# Altium schematic sheet ESP_MainChip.SchDoc
size 381 x 241 mm; SheetNumber: 2; SheetTotal: 2
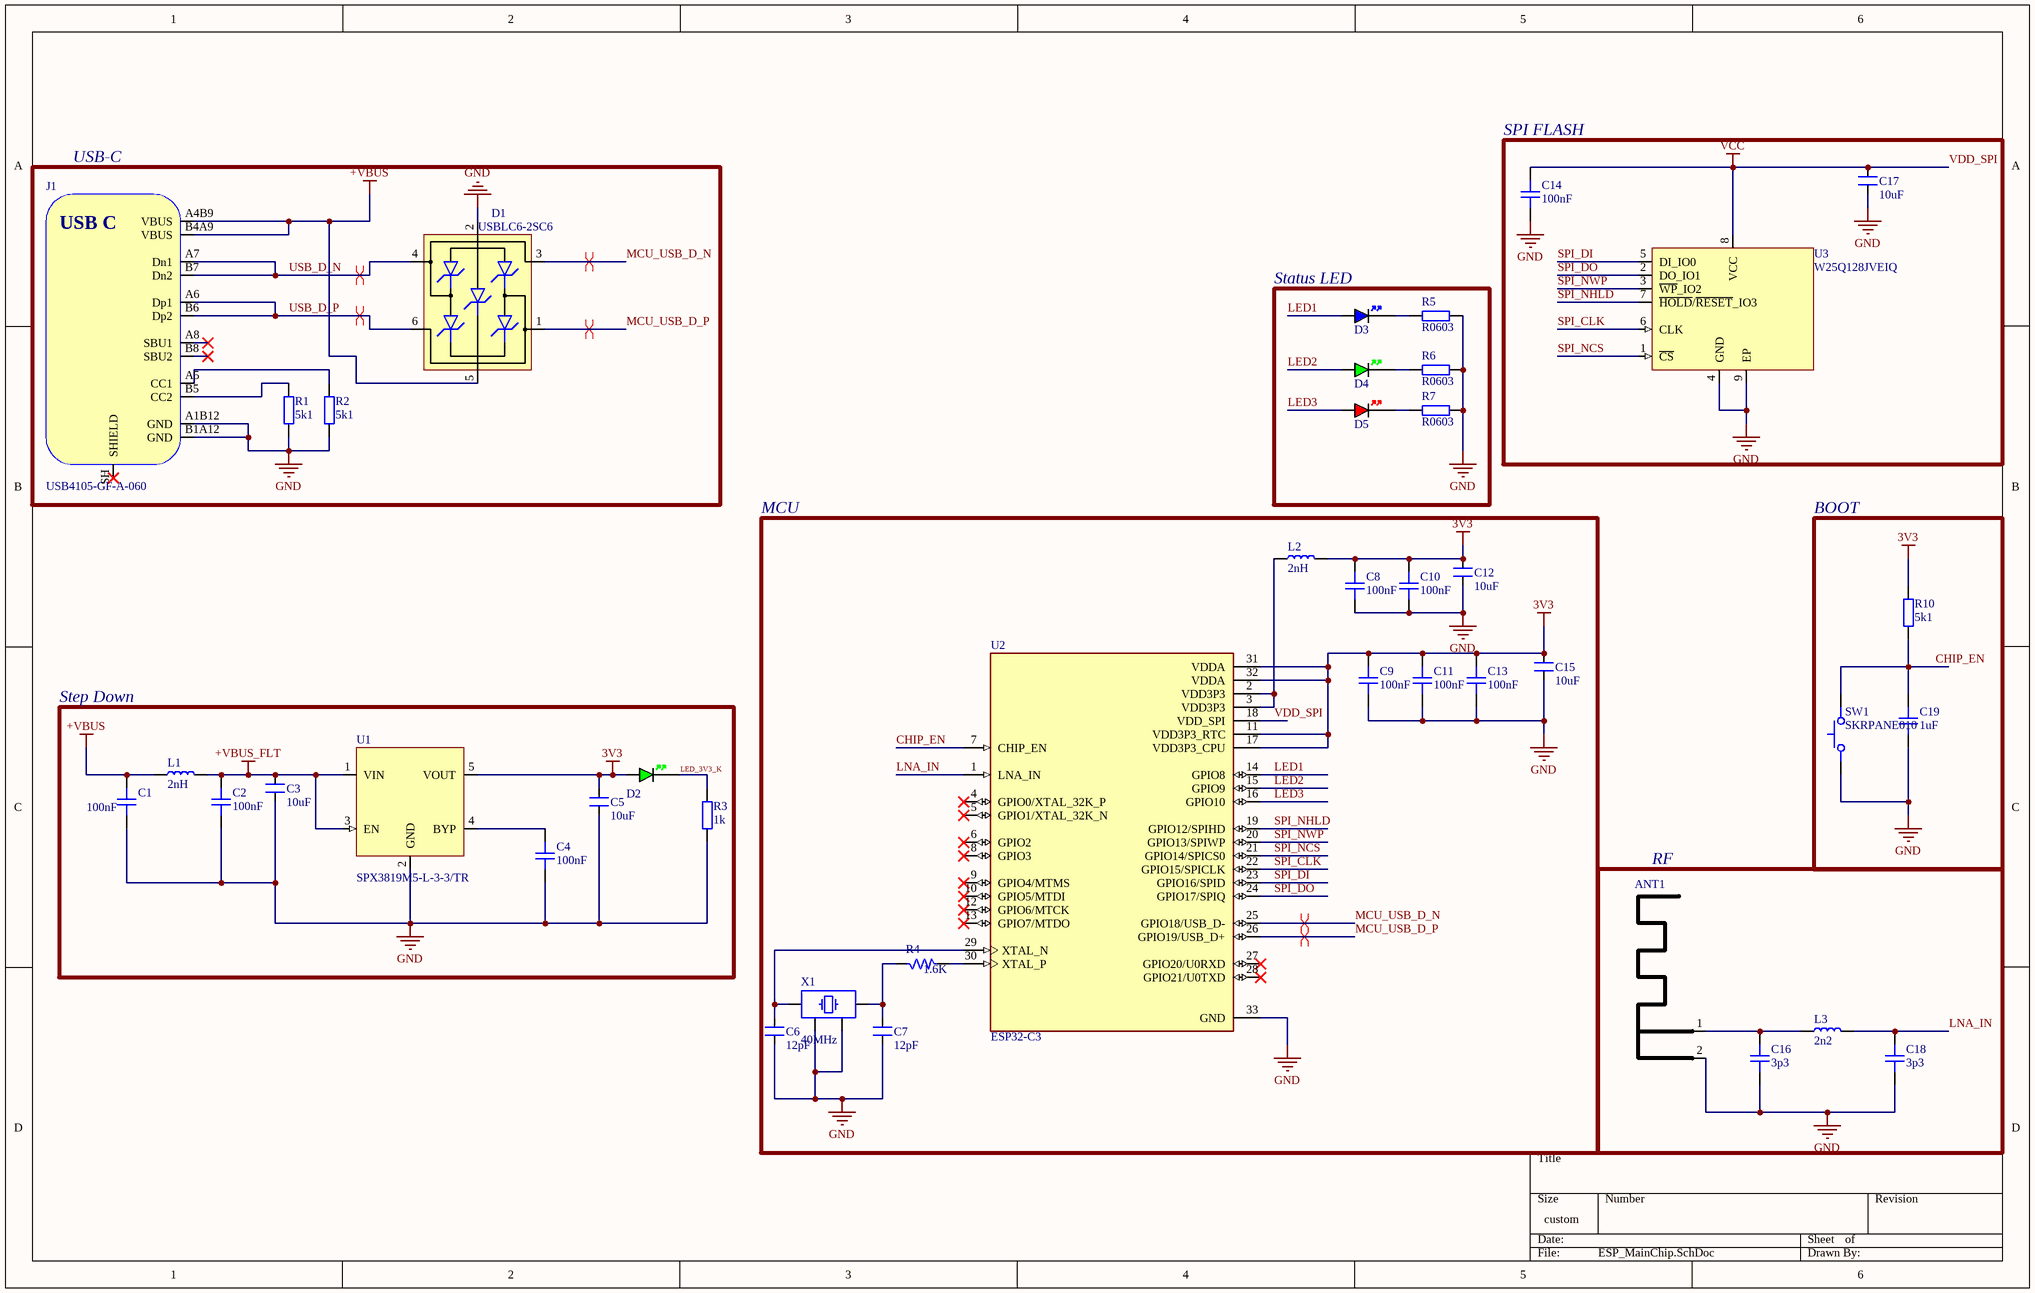
[diagram p0: ESP_MainChip.SchDoc]

## Parts
ANT1  PCB Antenna 2.4GHz 50Ohm  [ANT_IFA_USB_2_4GHZ_50R]  (value not drawn)  (no BOM)
C1  100nF  [CAP_0603]
C2  100nF  [CAP_0603]
C3  10uF  [CAP_1206]
C4  100nF  [CAP_0603]
C5  10uF  [CAP_1206]
C6  12pF  [CAP_0805]
C7  12pF  [CAP_0805]
C8  100nF  [CAP_0603]
C9  100nF  [CAP_0603]
C10  100nF  [CAP_0603]
C11  100nF  [CAP_0603]
C12  10uF  [CAP_1206]
C13  100nF  [CAP_0603]
C14  100nF  [CAP_0603]
C15  10uF  [CAP_1206]
C16  3p3  [CAP_0201]
C17  10uF  [CAP_1206]
C18  3p3  [CAP_0201]
C19  1uF  [CAP_0603]
D1  USBLC6-2SC6  [SOT-23-6]
D2  GREEN  [LED_0402_GREEN]  (value not drawn)
D3  BLUE  [LED_0402_BLUE]  (value not drawn)
D4  GREEN  [LED_0402_GREEN]  (value not drawn)
D5  RED  [LED_0402_RED]  (value not drawn)
J1  USB4105-GF-A-060  [USB4105-GF-A-060]
L1  2nH  [IND_0603]
L2  2nH  [IND_0603]
L3  2n2  [IND_1008]
R1  5k1  [RES_0805]
R2  5k1  [RES_0805]
R3  1k  [RES_0603]
R4  1.6K  [RES_0603]
R5  R0603  [RES_0603]
R6  R0603  [RES_0603]
R7  R0603  [RES_0603]
R10  5k1  [RES_0805]
SW1  SKRPANE010  [SKRPANE010]
U1  SPX3819M5-L-3-3/TR  [SOT-23-5]
U2  ESP32-C3  [QFN50P500X500X90-33N]
U3  W25Q128JVEIQ  [WSON-8-8X6]
X1  40MHz  [XTAL_2016]

## Blocks framed on the sheet
USB-C: D1 J1 R1 R2
SPI FLASH: C14 C17 U3
Status LED: D3-D5 R5-R7
MCU: C6-C13 C15 L2 R4 U2 X1
BOOT: C19 R10 SW1
Step Down: C1-C5 D2 L1 R3 U1
RF: ANT1 C16 C18 L3

## Nets
3V3: C5.2 C8.2 C9.2 C10.2 C11.2 C12.2 C13.2 C15.2 D2.A L2.2 R10.2 U1.5(VOUT) U2.11(VDD3P3_RTC) U2.17(VDD3P3_CPU) U2.31(VDDA) U2.32(VDDA)
+VBUS: C1.2 D1.5(VBUS) J1.A4B9(VBUS) J1.B4A9(VBUS) L1.1
+VBUS_FLT: C2.2 C3.2 L1.2 U1.1(VIN) U1.3(EN)
GND: ANT1.2(GND) C1.1 C2.1 C3.1 C4.1 C5.1 C6.1 C7.1 C8.1 C9.1 C10.1 C11.1 C12.1 C13.1 C14.1 C15.1 C16.1 C17.1 C18.1 C19.1 D1.2(GND) J1.A1B12(GND) J1.B1A12(GND) R1.1 R2.1 R3.1 R5.1 R6.1 R7.1 SW1.12 U1.2(GND) U2.33(GND) U3.4(GND) U3.9(EP) X1.2 X1.4
VDD_SPI: C14.2 C17.2 U2.18(VDD_SPI) U3.8(VCC)  [also labelled VCC]
CHIP_EN: C19.2 R10.1 SW1.34 U2.7(CHIP_EN)
LED1: D3.A U2.14(GPIO8)
LED2: D4.A U2.15(GPIO9)
LED3: D5.A U2.16(GPIO10)
LED_3V3_K: D2.K R3.2
LNA_IN: C18.2 L3.2 U2.1(LNA_IN)
MCU_USB_D_N: D1.3(IO2) U2.25(GPIO18/USB_D-)
MCU_USB_D_P: D1.1(IO1) U2.26(GPIO19/USB_D+)
SPI_CLK: U2.22(GPIO15/SPICLK) U3.6(CLK)
SPI_DI: U2.23(GPIO16/SPID) U3.5(DI_IO0)
SPI_DO: U2.24(GPIO17/SPIQ) U3.2(DO_IO1)
SPI_NCS: U2.21(GPIO14/SPICS0) U3.1(~{CS})
SPI_NHLD: U2.19(GPIO12/SPIHD) U3.7(~{HOLD}/~{RESET}_IO3)
SPI_NWP: U2.20(GPIO13/SPIWP) U3.3(~{WP}_IO2)
USB_D_N: D1.4(IO2) J1.A7(Dn1) J1.B7(Dn2)
USB_D_P: D1.6(IO1) J1.A6(Dp1) J1.B6(Dp2)
NetANT1_1: ANT1.1(RF) C16.2 L3.1
NetC4_2: C4.2 U1.4(BYP)
NetC6_2: C6.2 U2.29(XTAL_N) X1.1
NetC7_2: C7.2 R4.1 X1.3
NetD3_K: D3.K R5.2
NetD4_K: D4.K R6.2
NetD5_K: D5.K R7.2
NetJ1_A5: J1.A5(CC1) R2.2
NetJ1_B5: J1.B5(CC2) R1.2
NetL2_1: L2.1 U2.2(VDD3P3) U2.3(VDD3P3)
NetR4_2: R4.2 U2.30(XTAL_P)

Not connected (* = marked no-connect by the designer): J1 A8(SBU1)* B8(SBU2)* SH(SHIELD)*; U2 4(GPIO0/XTAL_32K_P)* 5(GPIO1/XTAL_32K_N)* 6(GPIO2)* 8(GPIO3)* 9(GPIO4/MTMS)* 10(GPIO5/MTDI)* 12(GPIO6/MTCK)* 13(GPIO7/MTDO)* 27(GPIO20/U0RXD)* 28(GPIO21/U0TXD)*

## Layout directives
differential pair: MCU_USB_D_N, MCU_USB_D_P, USB_D_N, USB_D_P

## Notes on the sheet
- (in symbol USB4105-GF-A-060) USB C

## Library data of the parts
ANT1 = ANT_IFA_USB_2_4GHZ_50R: Inverted F 2.4GHz ISM PCB Antenna 50 Ohm; ComponentLink1Description: Datasheet; ComponentLink1URL: https://www.ti.com/lit/an/swra117d/swra117d.pdf
C1 C2 C4 C8-C11 C13 C14 C19 = CAP_0603: Capacitor SMD 0603; Manufacturer: *; Manufacturer Part Number: *; Distributor Link: *; LCSC: *; Rating: *; Dielectric: *
C3 C5 C12 C15 C17 = CAP_10uF-50V-10%-1206: 10µF ±10% 50V Ceramic Capacitor X7R 1206 (3216 Metric); Manufacturer: KEMET; Manufacturer Part Number: CL31B106KBHNNNE; Alternate Part Number-1: GRT31CR61H106ME01L; Case/Package: 1206; Supplier-1: SIRICOM; Supplier Part Number-1: CC1206KKX5R9BB106
C6 C7 = CAP_12pF-50V-5%-0805: 12pF ±5% 50V Ceramic Capacitor C0G, NP0 0805 (2012 Metric); Manufacturer: KEMET; Manufacturer Part Number: CC0805JRNPO9BN120; Alternate Part Number-1: NA; Case/Package: 0805; Supplier-1: SIRICOM; Supplier Part Number-1: 0805N120J500CT
C16 C18 = CAP_0201: Capacitor SMD 0201; Manufacturer: *; Manufacturer Part Number: *; Distributor Link: *; LCSC: *; Rating: *; Dielectric: *
D1 = USBLC6-2SC6: Low-Capacitance ESD Protection USB; Manufacturer: STMicroelectronics; Manufacturer Part Number: USBLC6-2SC6; Distributor Link: https://www.mouser.de/ProductDetail/STMicroelectronics/USBLC6-2SC6?qs=po45yt2pPpu%2FhNIlwQdTlg%3D%3D
D2 D4 = LED_0402_GREEN: LED 0402 GREEN SMD
D3 = LED_0402_BLUE: LED 0402 BLUE SMD
D5 = LED_0402_RED: LED 0402 RED SMD
J1 = USB4105-GF-A-060: USB Connector Type C SMT 12 Pin; Manufacturer: GCT; Manufacturer Part Number: USB4105-GF-A-060; Distributor Link: https://eu.mouser.com/ProductDetail/GCT/USB4105-GF-A-060?qs=QNEnbhJQKvY2mocwNJzgfA%3D%3D
L1 L2 = IND_0603: Inductor SMD 0603
L3 = IND_1008: Inductor SMD 1008
R1 R2 R10 = RES_0805: Resistor SMD 0805; Manufacturer: *; Manufacturer Part Number: *; Distributor Link: *; LCSC: *
R3 R5-R7 = RES_0603: Resistor SMD 0603; Manufacturer: *; Manufacturer Part Number: *; Distributor Link: *; LCSC: *
R4 = RES_1.6K-0.1W-1%-0603: 1.6 kOhms ±1% 0.1W, 1/10W Chip Resistor 0603 (1608 Metric) Thin Film; Manufacturer: NA; Manufacturer Part Number: NA; Case/Package: 0603; Supplier-1: SIRICOM; Supplier Part Number-1: NA; Alternate Part Number-1: NA
SW1 = SKRPANE010: Tactile Switch SMD SPST; Manufacturer: Alps Alpine; Manufacturer Part Number: SKRPANE010
U1 = SPX3819M5-L-3-3/TR: 500mA +3.3V Low-Noise LDO Voltage Regulator; Manufacturer: MaxLinear; Manufacturer Part Number: SPX3819M5-L-3-3/TR
U2 = ESP32-C3: MF: {'manufacturer': u'Espressif Systems'}; Package: None; Price: None; Value: *; MP: ESP32-C3; Availability: Unavailable
U3 = W25Q128JVEIQ: 3V 128M-BIT SERIAL FLASH MEMORY WITH DUAL/QUAD SPI & QPI & DTR WSON-8; Manufacturer: Winbond; Manufacturer Part Number: W25Q128JVEIQ
X1 = XTAL_2016: Crystal SMD 4-Pin 2.0x1.6mm; Distributor Link: *